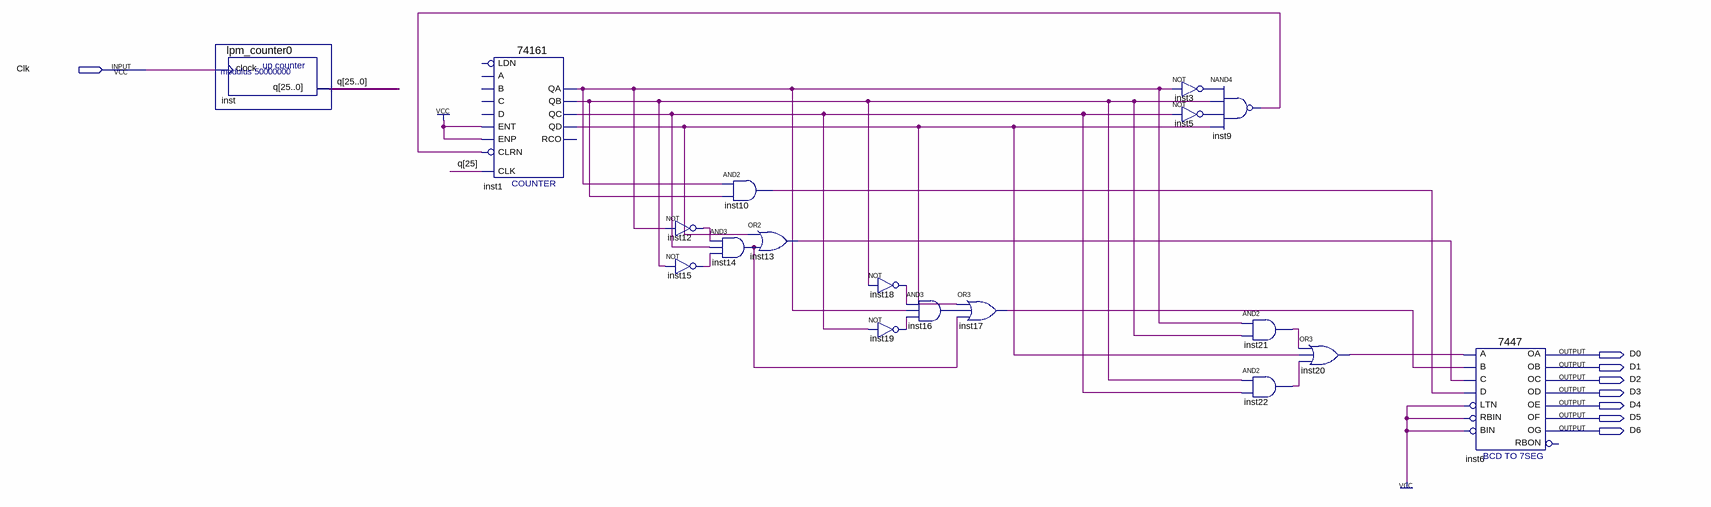
[diagram p0: schematic sheet]
// Quartus schematic Lec3_2.bdf as structural Verilog: 18 symbols, 8 pins
module Lec3_2 (
  input  Clk,
  output D0,
  output D1,
  output D2,
  output D3,
  output D4,
  output D5,
  output D6
);

  wire inst1_qa, inst1_qb, inst1_qc, inst1_qd, inst3_out, inst5_out, inst9_out, inst10_out, inst12_out,
       inst13_out, inst14_out, inst15_out, inst16_out, inst17_out, inst18_out, inst19_out, inst20_out,
       inst21_out, inst22_out;
  wire [25:0] q;

  lpm_counter0 inst (.clock(Clk), .q(q));
  \74161  inst1 (
    .CLRN(inst9_out), .CLK(q[25]), .ENP(1'b1), .ENT(1'b1), .QD(inst1_qd), .QC(inst1_qc), .QB(inst1_qb),
    .QA(inst1_qa));  // open: LDN, A, D, B, C, RCO
  not inst12 (inst12_out, inst1_qa);
  not inst15 (inst15_out, inst1_qb);
  and inst10 (inst10_out, inst1_qa, inst1_qb);
  or inst13 (inst13_out, inst1_qd, inst14_out);
  and inst14 (inst14_out, inst12_out, inst1_qc, inst15_out);
  not inst18 (inst18_out, inst1_qb);
  and inst16 (inst16_out, inst18_out, inst1_qa, inst19_out);
  not inst19 (inst19_out, inst1_qc);
  or inst17 (inst17_out, inst1_qd, inst16_out, inst14_out);
  not inst3 (inst3_out, inst1_qa);
  nand inst9 (inst9_out, inst3_out, inst1_qb, inst5_out, inst1_qd);
  not inst5 (inst5_out, inst1_qc);
  and inst21 (inst21_out, inst1_qa, inst1_qb);
  and inst22 (inst22_out, inst1_qb, inst1_qc);
  or inst20 (inst20_out, inst21_out, inst1_qd, inst22_out);
  \7447  inst6 (
    .LTN(1'b1), .B(inst17_out), .C(inst13_out), .D(inst10_out), .RBIN(1'b1), .BIN(1'b1), .A(inst20_out),
    .OB(D1), .OC(D2), .OE(D4), .OD(D3), .OF(D5), .OG(D6), .OA(D0));  // open: RBON
endmodule
